# Altium schematic sheet ESP32 with USB.SchDoc
size A2; SheetNumber: 1; SheetTotal: 1; SPICEModelCacheWAAAHCYK: <root> / <DocumentId>WAAAHCYK</DocumentId> / </root>
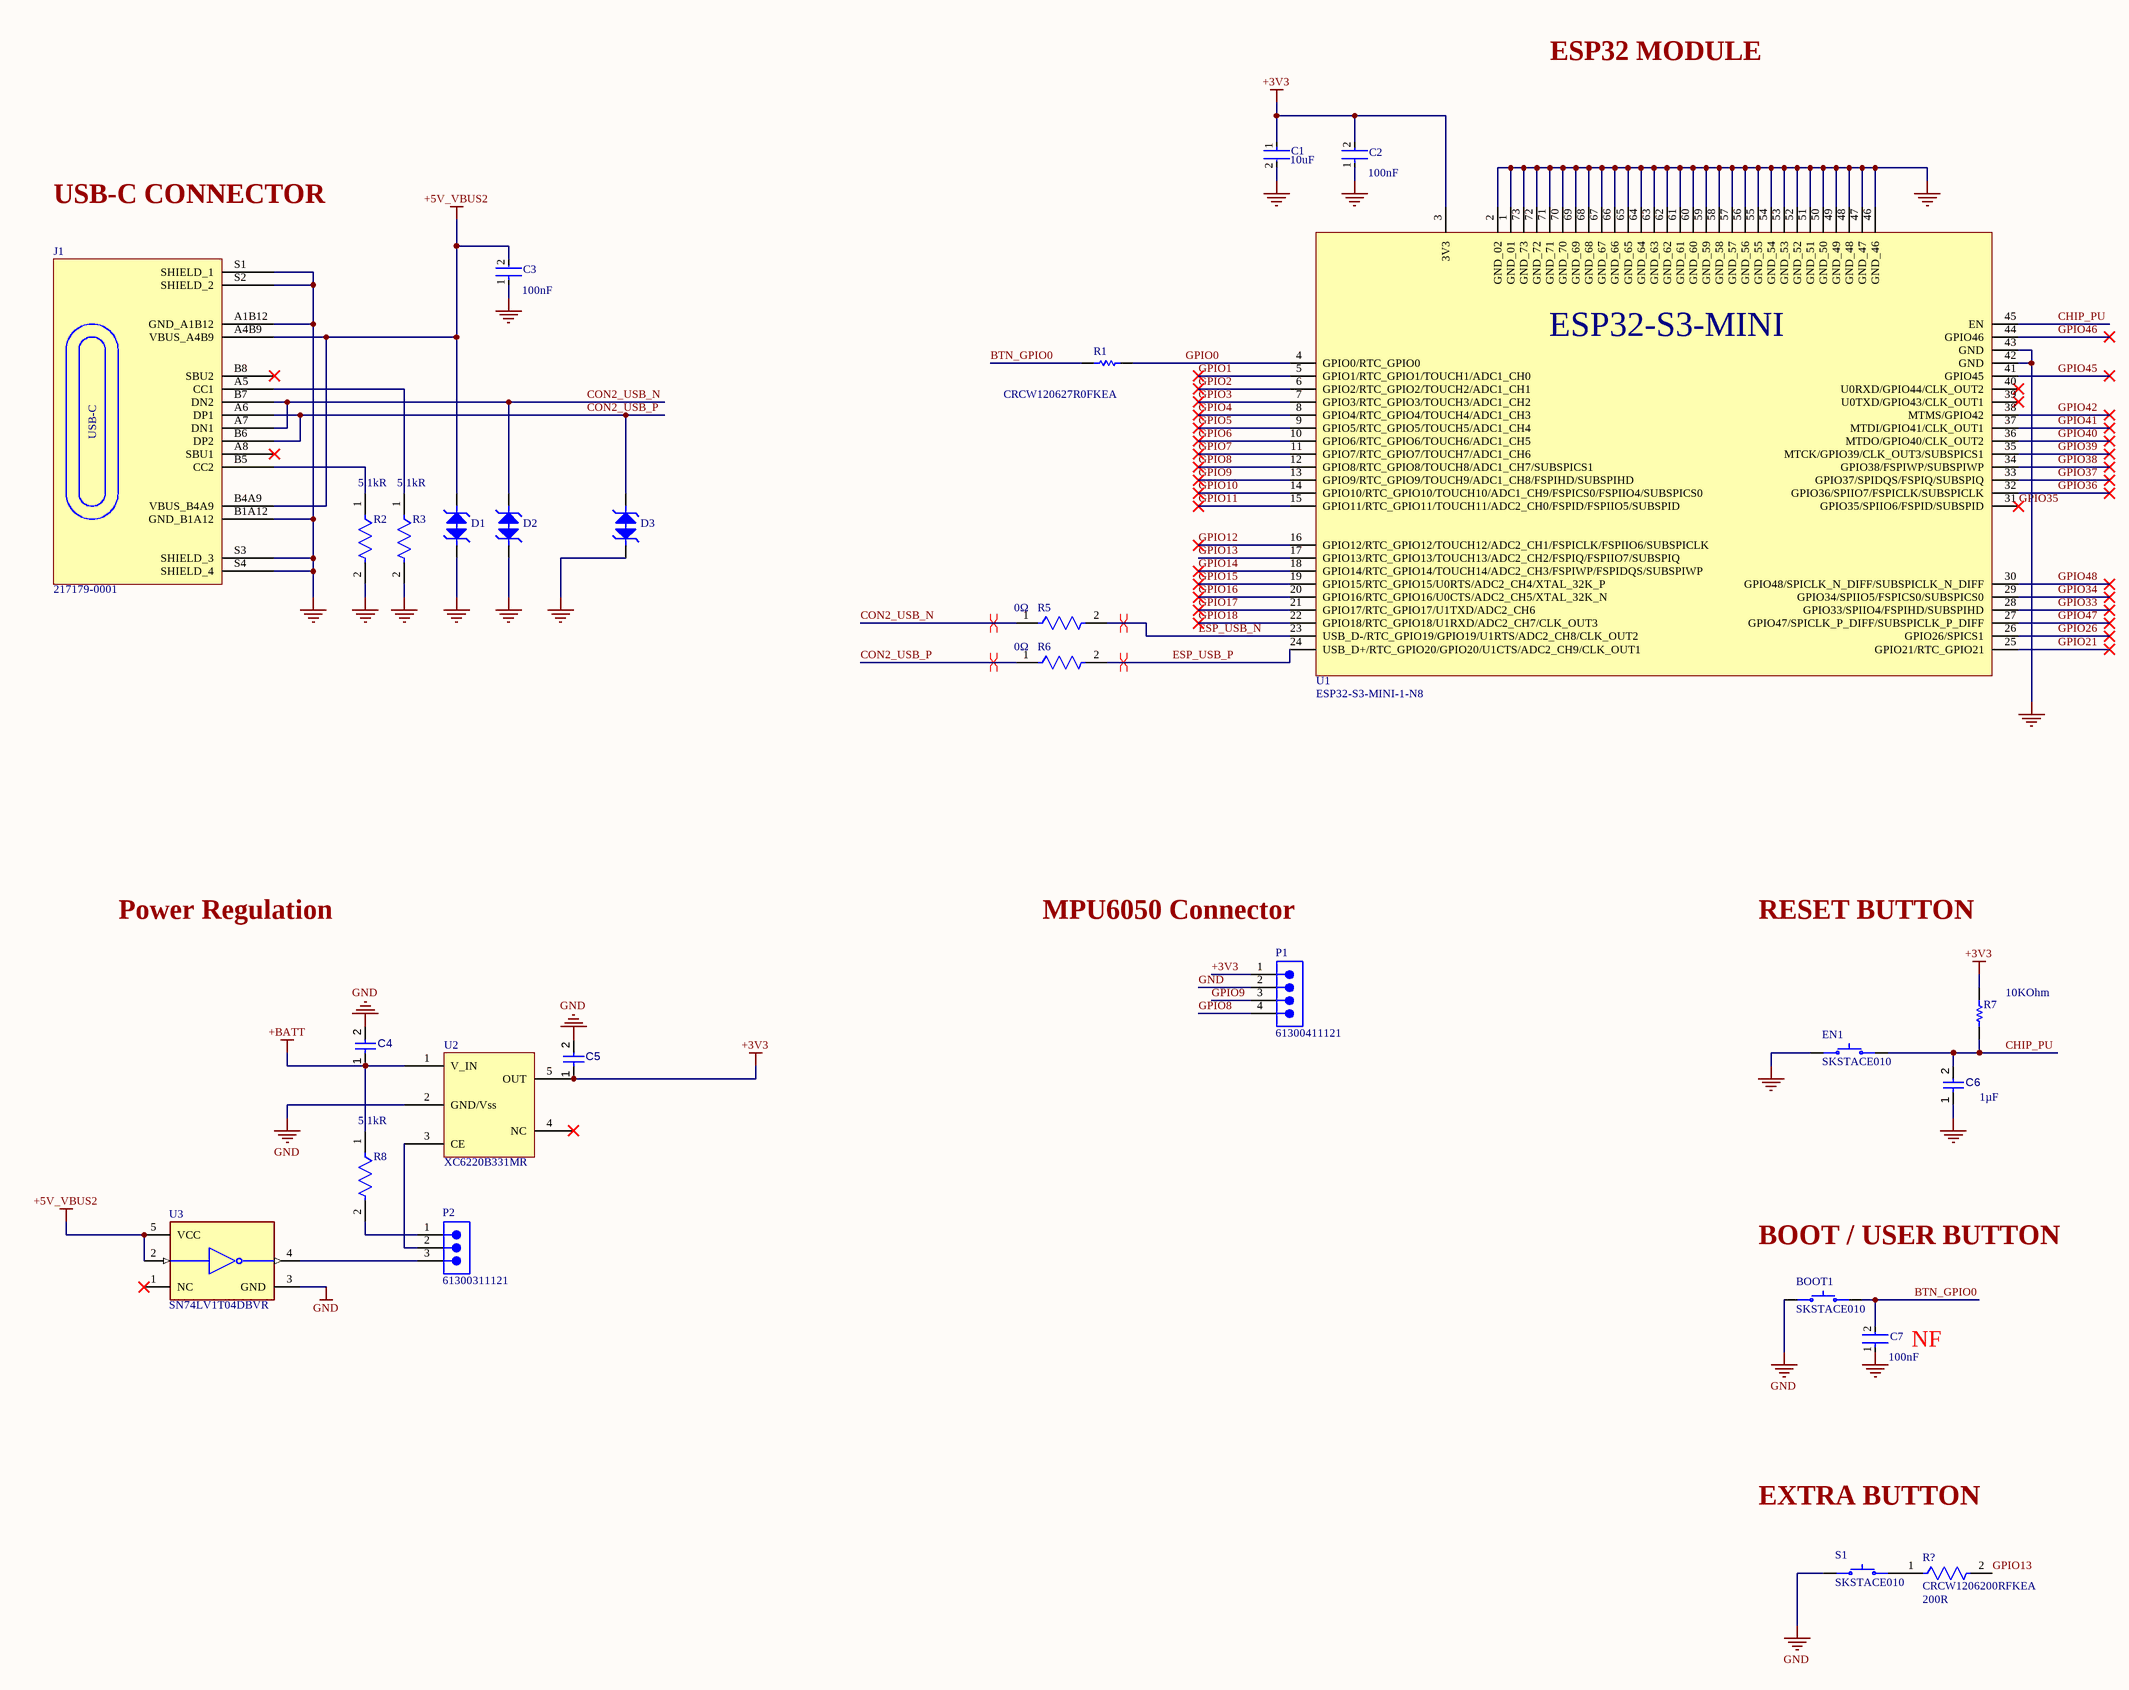
[diagram p0: ESP32 with USB.SchDoc]

## Parts
BOOT1  SKSTACE010  [SW_SKSTACE010]
C1  Capacitance: 10uF  [FP-CL31-IPC_A]  (hidden comment: CL31A106KAHNNNE)
C2  Capacitance: 100nF  [FP-1206-L_3_2_0_2-W_1_6_0-IPC_A]  (hidden comment: 12065C104JAT2A)
C3  Capacitance: 100nF  [FP-1206-L_3_2_0_2-W_1_6_0-IPC_A]  (hidden comment: 12065C104JAT2A)
C4  CL31B105KAHNNNE  [FP-CL31-IPC_A]  (value not drawn)
C5  CL31B105KAHNNNE  [FP-CL31-IPC_A]  (value not drawn)
C6  value 1µF  [FP-CL31-IPC_A]  (hidden comment: CL31B105KAHNNNE)
C7  Capacitance: 100nF  [FP-1206-L_3_2_0_2-W_1_6_0-IPC_A]  (hidden comment: 12065C104JAT2A)
D1  D5V0X1B2LPQ-7B  [DFN70P101X50-2M2]  (value not drawn)
D2  D5V0X1B2LPQ-7B  [DFN70P101X50-2M2]  (value not drawn)
D3  D5V0X1B2LPQ-7B  [DFN70P101X50-2M2]  (value not drawn)
EN1  SKSTACE010  [SW_SKSTACE010]
J1  217179-0001  [FP-2171790001-MFG]
P1  61300411121  [61300411121]
P2  61300311121  [61300311121]
R1  CRCW120627R0FKEA  [RESC3216X60X45ML10T20]
R2  Resistance: 5.1kR  [FP-CR1206-IPC_A]  (hidden comment: CR1206-FX-5101ELF)
R3  Resistance: 5.1kR  [FP-CR1206-IPC_A]  (hidden comment: CR1206-FX-5101ELF)
R5  value 0Ω  [FP-RC1206-IPC_A]  (hidden comment: RC1206JR-070RL)
R6  value 0Ω  [FP-RC1206-IPC_A]  (hidden comment: RC1206JR-070RL)
R7  Resistance: 10KOhm  [RESC3116X65X40ML10T20]  (hidden comment: RC1206FR-0710KL)
R8  Resistance: 5.1kR  [FP-CR1206-IPC_A]  (hidden comment: CR1206-FX-5101ELF)
R?  CRCW1206200RFKEA  Resistance: 200R  [FP-CRCW1206-e3-IPC_C]
S1  SKSTACE010  [SW_SKSTACE010]
U1  ESP32-S3-MINI-1-N8  [XCVR_ESP32-S3-MINI-1-N8]
U2  XC6220B331MR  [SOT23-5]
U3  SN74LV1T04DBVR  [FP-DBV0005A-IPC_A]

## Nets
+3V3: C1.1 C2.2 C5.1 P1.1 R7.2 U1.3(3V3) U2.5(OUT)
+5V_VBUS2: C3.2 D1.2 J1.A4B9(VBUS_A4B9) J1.B4A9(VBUS_B4A9) U3.2(A) U3.5(VCC)
+BATT: C4.1 R8.1 U2.1(V_IN)
GND: BOOT1.1 C1.2 C2.1 C3.1 C4.2 C5.2 C6.1 C7.1 D1.1 D2.1 D3.1 EN1.1 J1.A1B12(GND_A1B12) J1.B1A12(GND_B1A12) J1.S1(SHIELD_1) J1.S2(SHIELD_2) J1.S3(SHIELD_3) J1.S4(SHIELD_4) P1.2 R2.2 R3.2 S1.1 U1.1(GND_01) U1.2(GND_02) U1.42(GND) U1.43(GND) U1.46(GND_46) U1.47(GND_47) U1.48(GND_48) U1.49(GND_49) U1.50(GND_50) U1.51(GND_51) U1.52(GND_52) U1.53(GND_53) U1.54(GND_54) U1.55(GND_55) U1.56(GND_56) U1.57(GND_57) U1.58(GND_58) U1.59(GND_59) U1.60(GND_60) U1.61(GND_61) U1.62(GND_62) U1.63(GND_63) U1.64(GND_64) U1.65(GND_65) U1.66(GND_66) U1.67(GND_67) U1.68(GND_68) U1.69(GND_69) U1.70(GND_70) U1.71(GND_71) U1.72(GND_72) U1.73(GND_73) U2.2(GND/Vss) U3.3(GND)
BTN_GPIO0: BOOT1.2 C7.2 R1.1
CHIP_PU: C6.2 EN1.2 R7.1 U1.45(EN)
CON2_USB_N: D2.2 J1.A7(DN1) J1.B7(DN2) R5.1
CON2_USB_P: D3.2 J1.A6(DP1) J1.B6(DP2) R6.1
ESP_USB_N: R5.2 U1.23(USB_D-/RTC_GPIO19/GPIO19/U1RTS/ADC2_CH8/CLK_OUT2)
ESP_USB_P: R6.2 U1.24(USB_D+/RTC_GPIO20/GPIO20/U1CTS/ADC2_CH9/CLK_OUT1)
GPIO0: R1.2 U1.4(GPIO0/RTC_GPIO0)
GPIO1: U1.5(GPIO1/RTC_GPIO1/TOUCH1/ADC1_CH0)
GPIO2: U1.6(GPIO2/RTC_GPIO2/TOUCH2/ADC1_CH1)
GPIO3: U1.7(GPIO3/RTC_GPIO3/TOUCH3/ADC1_CH2)
GPIO4: U1.8(GPIO4/RTC_GPIO4/TOUCH4/ADC1_CH3)
GPIO5: U1.9(GPIO5/RTC_GPIO5/TOUCH5/ADC1_CH4)
GPIO6: U1.10(GPIO6/RTC_GPIO6/TOUCH6/ADC1_CH5)
GPIO7: U1.11(GPIO7/RTC_GPIO7/TOUCH7/ADC1_CH6)
GPIO8: P1.4 U1.12(GPIO8/RTC_GPIO8/TOUCH8/ADC1_CH7/SUBSPICS1)
GPIO9: P1.3 U1.13(GPIO9/RTC_GPIO9/TOUCH9/ADC1_CH8/FSPIHD/SUBSPIHD)
GPIO10: U1.14(GPIO10/RTC_GPIO10/TOUCH10/ADC1_CH9/FSPICS0/FSPIIO4/SUBSPICS0)
GPIO11: U1.15(GPIO11/RTC_GPIO11/TOUCH11/ADC2_CH0/FSPID/FSPIIO5/SUBSPID)
GPIO12: U1.16(GPIO12/RTC_GPIO12/TOUCH12/ADC2_CH1/FSPICLK/FSPIIO6/SUBSPICLK)
GPIO13: R?.2 U1.17(GPIO13/RTC_GPIO13/TOUCH13/ADC2_CH2/FSPIQ/FSPIIO7/SUBSPIQ)
GPIO14: U1.18(GPIO14/RTC_GPIO14/TOUCH14/ADC2_CH3/FSPIWP/FSPIDQS/SUBSPIWP)
GPIO15: U1.19(GPIO15/RTC_GPIO15/U0RTS/ADC2_CH4/XTAL_32K_P)
GPIO16: U1.20(GPIO16/RTC_GPIO16/U0CTS/ADC2_CH5/XTAL_32K_N)
GPIO17: U1.21(GPIO17/RTC_GPIO17/U1TXD/ADC2_CH6)
GPIO18: U1.22(GPIO18/RTC_GPIO18/U1RXD/ADC2_CH7/CLK_OUT3)
GPIO21: U1.25(GPIO21/RTC_GPIO21)
GPIO26: U1.26(GPIO26/SPICS1)
GPIO33: U1.28(GPIO33/SPIIO4/FSPIHD/SUBSPIHD)
GPIO34: U1.29(GPIO34/SPIIO5/FSPICS0/SUBSPICS0)
GPIO35: U1.31(GPIO35/SPIIO6/FSPID/SUBSPID)
GPIO36: U1.32(GPIO36/SPIIO7/FSPICLK/SUBSPICLK)
GPIO37: U1.33(GPIO37/SPIDQS/FSPIQ/SUBSPIQ)
GPIO38: U1.34(GPIO38/FSPIWP/SUBSPIWP)
GPIO39: U1.35(MTCK/GPIO39/CLK_OUT3/SUBSPICS1)
GPIO40: U1.36(MTDO/GPIO40/CLK_OUT2)
GPIO41: U1.37(MTDI/GPIO41/CLK_OUT1)
GPIO42: U1.38(MTMS/GPIO42)
GPIO45: U1.41(GPIO45)
GPIO46: U1.44(GPIO46)
GPIO47: U1.27(GPIO47/SPICLK_P_DIFF/SUBSPICLK_P_DIFF)
GPIO48: U1.30(GPIO48/SPICLK_N_DIFF/SUBSPICLK_N_DIFF)
NetJ1_A5: J1.A5(CC1) R3.1
NetJ1_B5: J1.B5(CC2) R2.1
NetP2_1: P2.1 R8.2
NetP2_2: P2.2 U2.3(CE)
NetP2_3: P2.3 U3.4(Y)
NetR?_1: R?.1 S1.2

Not connected (* = marked no-connect by the designer): J1 A8(SBU1)* B8(SBU2)*; U1 39(U0TXD/GPIO43/CLK_OUT1)* 40(U0RXD/GPIO44/CLK_OUT2)*; U2 4(NC)*; U3 1(NC)*

## Layout directives
differential pair; differential pair class DIFF90: CON2_USB_N, CON2_USB_P, ESP_USB_N, ESP_USB_P

## Notes on the sheet
- ESP32 MODULE
- USB-C CONNECTOR
- Power Regulation
- (near P1) MPU6050 Connector
- RESET BUTTON
- (near BOOT1) BOOT / USER BUTTON
- (near C7) NF
- EXTRA BUTTON
- (in symbol 217179-0001) USB-C
- (in symbol ESP32-S3-MINI-1-N8) ESP32-S3-MINI

## Library data of the parts
BOOT1 EN1 S1 = SKSTACE010: Switch Tactile N.O. SPST Round Button J-Bend 0.05A 16VDC 500000Cycles 4N SMD T/R; Package: None; Price: None; Value: *; MP: SKSTACE010; Availability: Unavailable
C1 = CMP-2000-06107-2: Cap Ceramic 10uF 25V X5R ±10% SMD 1206 +85°C Embossed T/R; Max Operating Temperature: 85°C; Min Operating Temperature: -55°C; Voltage: 25V; Case/Package: 1206; Mount: Surface Mount; Length: 3.2mm; Width: 0.063inch; Contact Plating: Tin; Depth: 1.6mm; Case Code (Metric): 3216; Tolerance: 10%; Height: 1.6mm; Thickness: 0.071inch; Material: Ceramic; Voltage Rating: 25V; Packaging: Tape and Reel; Voltage Rating (DC): 25V; Case Code (Imperial): 1206; Lead Free: Lead Free; Dielectric: X5R; Radiation Hardening: No
C2 C3 C7 = CMP-04427-019132-1: General Purpose Ceramic Capacitor, 1206, 100nF, 5%, X7R, 15%, 50V; Insulation Resistance: 100GR; Dissipation Factor: 2.5%; Depth: 1.6mm; Case/Package: 1206; REACH SVHC: No SVHC; Height: 0.5mm; Termination: SMD/SMT; Packaging: Cut Tape; Voltage: 50V; Min Operating Temperature: -55°C; Width: 1.6mm; Dielectric: X7R; Series: X7R; Case Code (Metric): 3216; Contact Plating: Tin; Package Quantity: 4000; Lead Free: Lead Free; Thickness: 0.037inch; Voltage Rating (DC): 50V; RoHS Compliant: Yes; Voltage Rating: 50V; Length: 3.2mm; Tolerance: 5%; Mount: Surface Mount; Radiation Hardening: No; Weight: 0.000571oz; Max Operating Temperature: 125°C; Dielectric Material: Ceramic; Case Code (Imperial): 1206
C4 C5 = CMP-001-00086-1: Ceramic Capacitor, Multilayer, Ceramic, 25V, 10% +Tol, 10% -Tol, X7R, 15% TC, 1uF, Surface Mount, 1206; Value: 1µF; Mounting Technology: Surface Mount; Capacitor Type: Ceramic; Case/Package: 1206; Max Operating Temperature: 125°C; Min Operating Temperature: -55°C; Pins: 2; RoHS Compliant: Yes
C6 = CMP-001-00086-1: Ceramic Capacitor, Multilayer, Ceramic, 25V, 10% +Tol, 10% -Tol, X7R, 15% TC, 1uF, Surface Mount, 1206; Mounting Technology: Surface Mount; Capacitor Type: Ceramic; Case/Package: 1206; Max Operating Temperature: 125°C; Min Operating Temperature: -55°C; Pins: 2; RoHS Compliant: Yes
D1-D3 = D5V0X1B2LPQ-7B: TVS Diode - ULTRA LOW CAPACITANCE BIDIRECTIONAL
J1 = 217179-0001: CONN RCP USB2.0 TYP C 24P SMD RA; Manufacturer: Molex; Supplier: Digikey; Supplier Part Number: 900-2171790001CT-ND; Manufacturer Part Number: 217179-0001; RoHS: No; Category: Connectors; Stock: 7228; Pricing: 1=0.9, 10=0.745, 100=0.6212 (USD); LCSC Part Number: C3197684
P1 = CMP-1502-01064-3: NexarPartId: 32855522; Operating Supply Voltage: 250V; Pitch: 2.54mm; Contact Resistance: 20mΩ; Number of Positions: 4; Current Rating: 3A; Connector Type: Male Pin; Gender: Male; Contact Plating: Gold; Height: 8.89mm; Lead Pitch: 2.54mm; Lead Free: Lead Free; Contact Mating Length: 5.9944mm; Number of Rows: 1; Termination: Solder; Packaging: Bulk; REACH SVHC: Unknown; Min Operating Temperature: -40°C; RoHS: Compliant; Number of Contacts: 4; Voltage Rating: 250V; Color: Black; Max Operating Temperature: 105°C; Contact Material: Copper; Mount: Through Hole; Orientation: Vertical; Number of Pins: 4
P2 = CMP-1502-01062-3: NexarPartId: 32855521; Current Rating: 3A; Voltage Rating: 250V; Number of Positions: 3; Pitch: 2.54mm; Contact Resistance: 20mΩ; Connector Type: Male Pin; Gender: Male; REACH SVHC: Unknown; Packaging: Bulk; Contact Material: Copper; Min Operating Temperature: -40°C; Number of Rows: 1; Orientation: Vertical; RoHS: Compliant; Contact Plating: Gold; Max Operating Temperature: 105°C; Mount: Through Hole; Height: 8.94mm; Operating Supply Voltage: 250V; Number of Pins: 3; Contact Mating Length: 5.9944mm; Number of Contacts: 3; Color: Black; Lead Free: Lead Free; Lead Pitch: 2.54mm; Termination: Solder
R1 = CMP-2003-02015-1: 750mW Thick Film Resistors 200V ±1% ±100ppm/℃ 27Ω 1206 Chip Resistor - Surface Mount ROHS; Manufacturer: Vishay Dale; Resistance: 27ohm; Part Number: CRCW120627R0FKEA
R2 R3 R8 = CMP-07231-005130-1: Thick Film Chip Resistors 1206 5.1kΩ 0.25W 1% 100ppm/°C; Voltage Rating: 200V; Max Power Dissipation: 250mW; Min Operating Temperature: -55°C; Length: 3.2mm; Mount: Surface Mount; Tolerance: 1%; Military Standard: Not; Radiation Hardening: No; Case Code (Imperial): 1206; Composition: Thick Film; Max Operating Temperature: 155°C; Thickness: 610um; Height: 0.03inch; Features: Moisture Resistant; Number of Terminations: 2; Packaging: Tape and Reel; Termination: SMD/SMT; Case Code (Metric): 3216; Temperature Coefficient: 100ppm/°C; Contact Plating: Tin; Package Quantity: 1; Width: 0.063inch; Depth: 1.6mm; Power Rating: 250mW; Case/Package: 1206
R5 R6 = CMP-2100-03681-2: RES SMD 0 OHM JUMPER 1/4W 1206; Manufacturer: YAGEO; Voltage Rating: 200V; Temperature Coefficient: 300ppm/°C; Power Rating: 0.25W; Tolerance: 5%; Manufacturer Part Number: RC1206JR-070RL; Temperature Range Low: -55°C; Category: Res; Automotive: No; Ipc Land Pattern Name: RESC310160X55; Device Class L1: Passive Components; Temperature: -55°C to +155°C; ComponentLink2URL: https://www.yageo.com/upload/media/product/productsearch/datasheet/rchip/PYu-RC_Group_51_RoHS_L_10.pdf; Lead Free: Yes; Height: 0.65mm; Footprint Url: https://www.yageo.com/upload/website/yageo_PYu-R_Mount_10_19050818_343.pdf; Package: RC1206; Digikey Description: RES SMD 0 OHM JUMPER 1/4W 1206; Temperature Range High: +155°C; Device Class L3: Chip SMD Resistors; Device Class L2: Resistors; Octopart: https://octopart.com/rc1206jr-070rl-yageo-40025601; Resistance: 0Ω; Series: RC; ComponentLink2Description: Datasheet; Composition: Thick Film; RoHS: TRUE; Mouser Description: Resistor: thick film; SMD; 1206; 0O; 0.25W; ±5%; -55÷155°C
R7 = CMP-1014-00623-2: Chip Resistor, 10 KOhm, +/- 1%, 0.25 W, -55 to 155 degC, 1206 (3216 Metric), RoHS, Tape and Reel; Manufacturer: Yageo; Voltage Rating: 200V; Temperature Coefficient: 100ppm/degreesC; Power Rating: 250mW; Packaging: TapeandReel; Termination: SMD/SMT; REACH SVHC: Unknown; Tolerance: 1%; Height: 0.55mm; Composition: ThickFilm; Max Operating Temperature: 155degC; Datasheet Version: Rev. 5, 10/2016; Lead Free: LeadFree; Case Code (Metric): 3216; Depth: 1.6mm; Package Quantity: 5000; RoHSCompliant: true; Military Standard: Not; Case/Package: 1206; Case Code (Imperial): 1206; Min Operating Temperature: -55degC; Datasheet URL: http://www.yageo.com/NewPortal/yageodocoutput?fileName=/pdf/R-Chip/PYu-RC_Group_51_RoHS_L_5.pdf; Length: 3.1mm; Manufacturer URL: http://www.yageo.com/; Package Reference: 1206.0; Width: 1.6mm; Package Description: 2-Pin Surface Mount Device, Body 3.1 x 1.6 mm
R? = CMP-2003-01935-2: RES Thick Film, 200Ω, 1%, 0.25W, 100ppm/°C, 1206; Max Power Dissipation: 250mW; Voltage Rating (DC): 200V; Min Operating Temperature: -55°C; Length: 3.2mm; Composition: Thick Film; Number of Terminations: 2; Power Rating: 250mW; Temperature Coefficient: 100ppm/°C; Lead Free: Lead Free; Voltage Rating: 200V; Case Code (Metric): 3216; Features: Automotive AEC-Q200; Max Operating Temperature: 155°C; Height: 0.55mm; Case/Package: 1206; Contact Plating: Tin; Package Quantity: 10; Width: 1.6mm; Military Standard: Not; Number of Pins: 2; Weight: 0.000353oz; Working Voltage: 200V; Packaging: Tape and Reel; Depth: 1.6mm; Case Code (Imperial): 1206; Termination: SMD/SMT; Radiation Hardening: No; Tolerance: 1%
U1 = ESP32-S3-MINI-1-N8: SMD Module, ESP32-S3FN8, 8 mb Sp; Manufacturer: Espressif Systems; Supplier: Digikey; Supplier Part Number: 1965-ESP32-S3-MINI-1-N8CT-ND; Manufacturer Part Number: ESP32-S3-MINI-1-N8; RoHS: No; Category: LDO; Stock: 2024; Pricing: 1=3.1 (USD); LCSC Part Number: C2913206
U2 = XC6220B331MR: LDO - 70dB@(1kHz) 900mA Fixed 3.3V Positive electrode 5.5V SOT-23-5 Voltage Regulators - Linear, Low Drop Out (LDO) Regulators ROHS
U3 = CMP-0859-00120-4: IC INVERTER 1CH 1-INP SOT23-5; Number of Inputs: 1; Min Supply Voltage: 1.8V; High Level Output Current: 8mA; Quiescent Current: 1uA; Max Supply Voltage: 5.5V; Propagation Delay: 7ns; Weight: 0.001058oz; Package Quantity: 3000; Number of Channels: 1; Radiation Hardening: No; Mount: Surface Mount; RoHS Compliant: Yes; Number of Bits: 1; Max Operating Temperature: 125°C; Number of Circuits: 1; REACH SVHC: No SVHC; Logic Function: Inverter; Case/Package: SOT-23-5; Lead Free: Lead Free; Number of Pins: 5; Low Level Output Current: 8mA; Packaging: Tape and Reel; Min Operating Temperature: -40°C